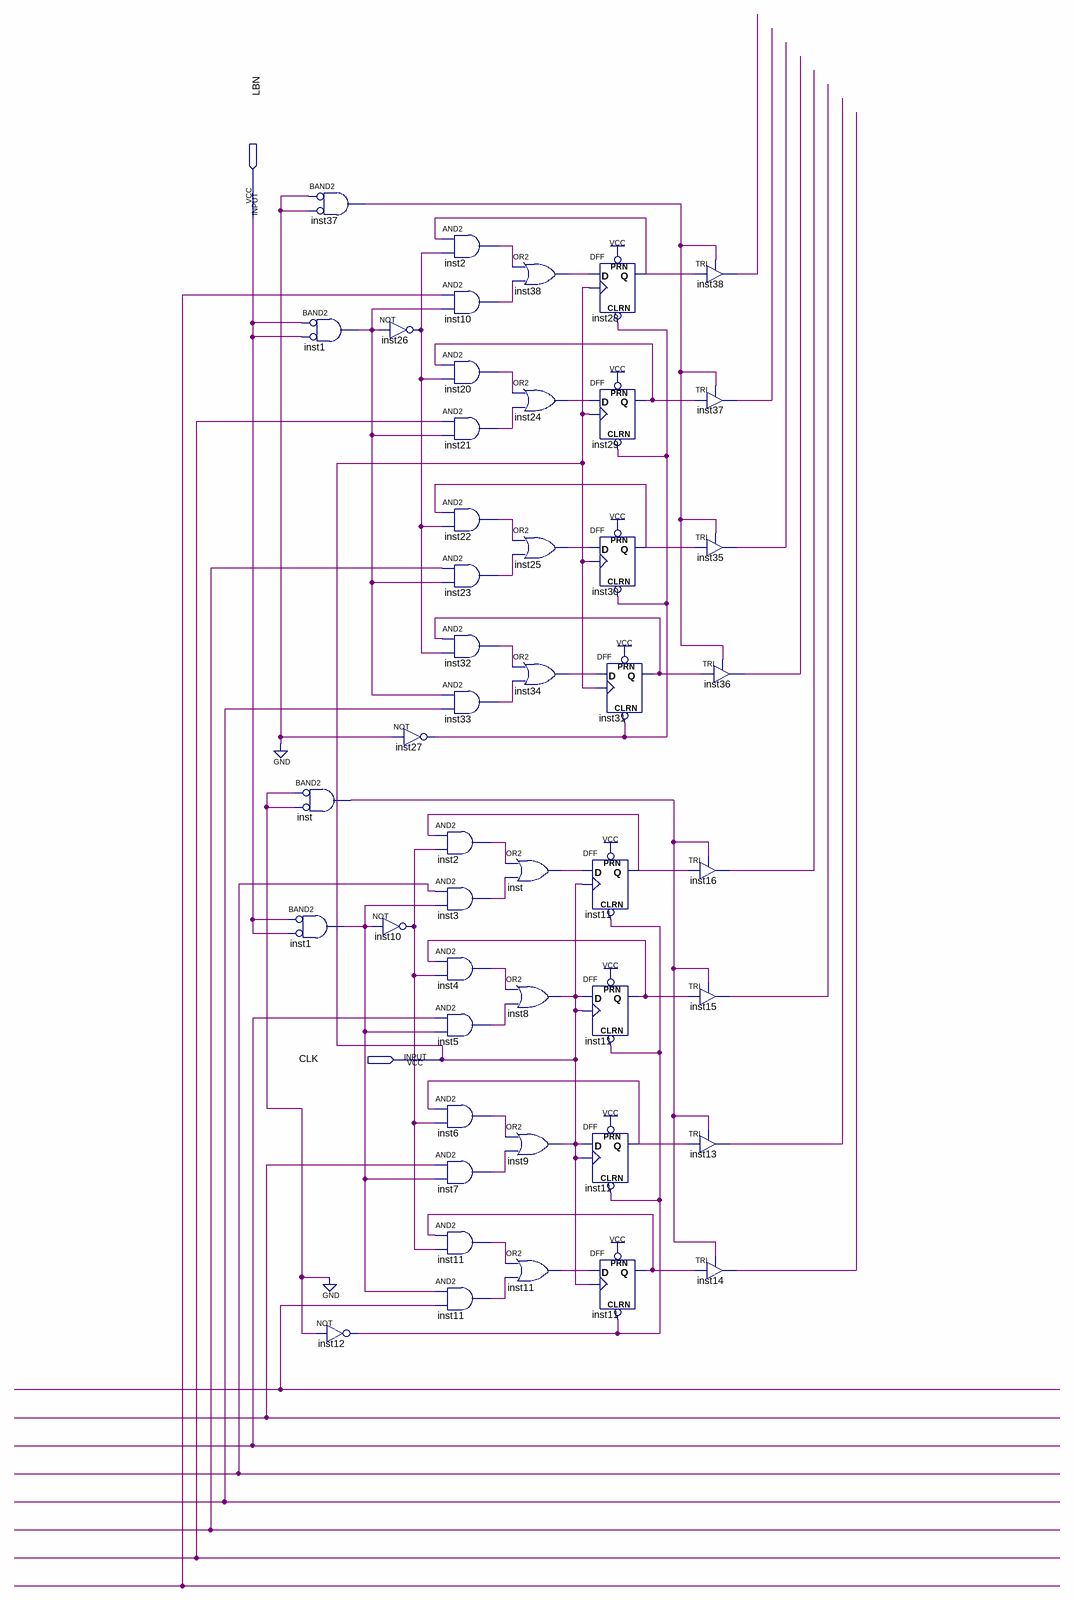
[diagram p0: schematic sheet]
// Quartus schematic registrador_generico.bdf as structural Verilog: 48 symbols, 2 pins
module registrador_generico (
  input  LBN,
  input  CLK
);

  wire inst1_out, inst1_out_2, inst2_out, inst2_out_2, inst3_out, inst4_out, inst5_out, inst6_out, inst7_out,
       inst10_out, inst10_out_2, inst11_out, inst11_out_2, inst11_out_3, inst11_q, inst11_q_2, inst11_q_3,
       inst11_q_4, inst12_out, inst13_out, inst14_out, inst15_out, inst16_out, inst20_out, inst21_out,
       inst22_out, inst23_out, inst24_out, inst25_out, inst26_out, inst27_out, inst28_q, inst29_q, inst30_q,
       inst31_q, inst32_out, inst33_out, inst34_out, inst35_out, inst36_out, inst37_out, inst37_out_2,
       inst38_out, inst38_out_2, inst_out, inst_out_2, undriven, undriven_2, undriven_3, undriven_4,
       undriven_5, undriven_6, undriven_7, undriven_8;

  and inst1 (inst1_out, ~LBN, ~LBN);  // BAND2
  and inst (inst_out_2, ~1'b0, ~1'b0);  // BAND2
  and inst1_dup2 (inst1_out_2, ~LBN, ~LBN);  // BAND2
  and inst37 (inst37_out, ~1'b0, ~1'b0);  // BAND2
  not inst12 (inst12_out, 1'b0);
  not inst26 (inst26_out, inst1_out);
  not inst27 (inst27_out, 1'b0);
  not inst10 (inst10_out_2, inst1_out_2);
  and inst2 (inst2_out_2, inst28_q, inst26_out);
  and inst10_dup2 (inst10_out, undriven_8, inst1_out);
  and inst20 (inst20_out, inst29_q, inst26_out);
  and inst21 (inst21_out, undriven_7, inst1_out);
  and inst22 (inst22_out, inst30_q, inst26_out);
  and inst23 (inst23_out, undriven_6, inst1_out);
  and inst32 (inst32_out, inst31_q, inst26_out);
  and inst33 (inst33_out, inst1_out, undriven_5);
  and inst2_dup2 (inst2_out, inst11_q_2, inst10_out_2);
  and inst3 (inst3_out, undriven_4, inst1_out_2);
  and inst4 (inst4_out, inst11_q, inst10_out_2);
  and inst5 (inst5_out, undriven_3, inst1_out_2);
  and inst6 (inst6_out, inst11_q_3, inst10_out_2);
  and inst7 (inst7_out, undriven_2, inst1_out_2);
  and inst11 (inst11_out, inst11_q_4, inst10_out_2);
  and inst11_dup2 (inst11_out_2, inst1_out_2, undriven);
  or inst38 (inst38_out, inst2_out_2, inst10_out);
  or inst24 (inst24_out, inst20_out, inst21_out);
  or inst25 (inst25_out, inst22_out, inst23_out);
  or inst34 (inst34_out, inst32_out, inst33_out);
  or inst_dup2 (inst_out, inst2_out, inst3_out);
  or inst8 (CLK, inst4_out, inst5_out);
  or inst9 (CLK, inst6_out, inst7_out);
  or inst11_dup3 (inst11_out_3, inst11_out, inst11_out_2);
  DFF inst11_dup4 (.CLRN(inst12_out), .CLK(CLK), .D(inst_out), .PRN(1'b1), .Q(inst11_q_2));
  DFF inst11_dup5 (.CLRN(inst12_out), .CLK(CLK), .D(CLK), .PRN(1'b1), .Q(inst11_q));
  DFF inst11_dup6 (.CLRN(inst12_out), .CLK(CLK), .D(CLK), .PRN(1'b1), .Q(inst11_q_3));
  DFF inst28 (.CLRN(inst27_out), .CLK(CLK), .D(inst38_out), .PRN(1'b1), .Q(inst28_q));
  DFF inst29 (.CLRN(inst27_out), .CLK(CLK), .D(inst24_out), .PRN(1'b1), .Q(inst29_q));
  DFF inst30 (.CLRN(inst27_out), .CLK(CLK), .D(inst25_out), .PRN(1'b1), .Q(inst30_q));
  DFF inst31 (.CLRN(inst27_out), .CLK(CLK), .D(inst34_out), .PRN(1'b1), .Q(inst31_q));
  DFF inst11_dup7 (.CLRN(inst12_out), .CLK(CLK), .D(inst11_out_3), .PRN(1'b1), .Q(inst11_q_4));
  TRI inst38_dup2 (.IN(inst28_q), .OE(inst37_out), .OUT(inst38_out_2));
  TRI inst37_dup2 (.IN(inst29_q), .OE(inst37_out), .OUT(inst37_out_2));
  TRI inst35 (.IN(inst30_q), .OE(inst37_out), .OUT(inst35_out));
  TRI inst16 (.IN(inst11_q_2), .OE(inst_out_2), .OUT(inst16_out));
  TRI inst15 (.IN(inst11_q), .OE(inst_out_2), .OUT(inst15_out));
  TRI inst13 (.IN(inst11_q_3), .OE(inst_out_2), .OUT(inst13_out));
  TRI inst14 (.IN(inst11_q_4), .OE(inst_out_2), .OUT(inst14_out));
  TRI inst36 (.IN(inst31_q), .OE(inst37_out), .OUT(inst36_out));
endmodule
